# Altium schematic sheet DB Connectors.SchDoc: DB Connectors
size B; DrawnBy: Jasper Yun; SheetNumber: 1; SheetTotal: 3; Competition: SAC 2021; Subteam: Avionics; University: McGill University; Location: Montreal, Quebec; Project: Avionics Project Name; MRT: McGill Rocket Team
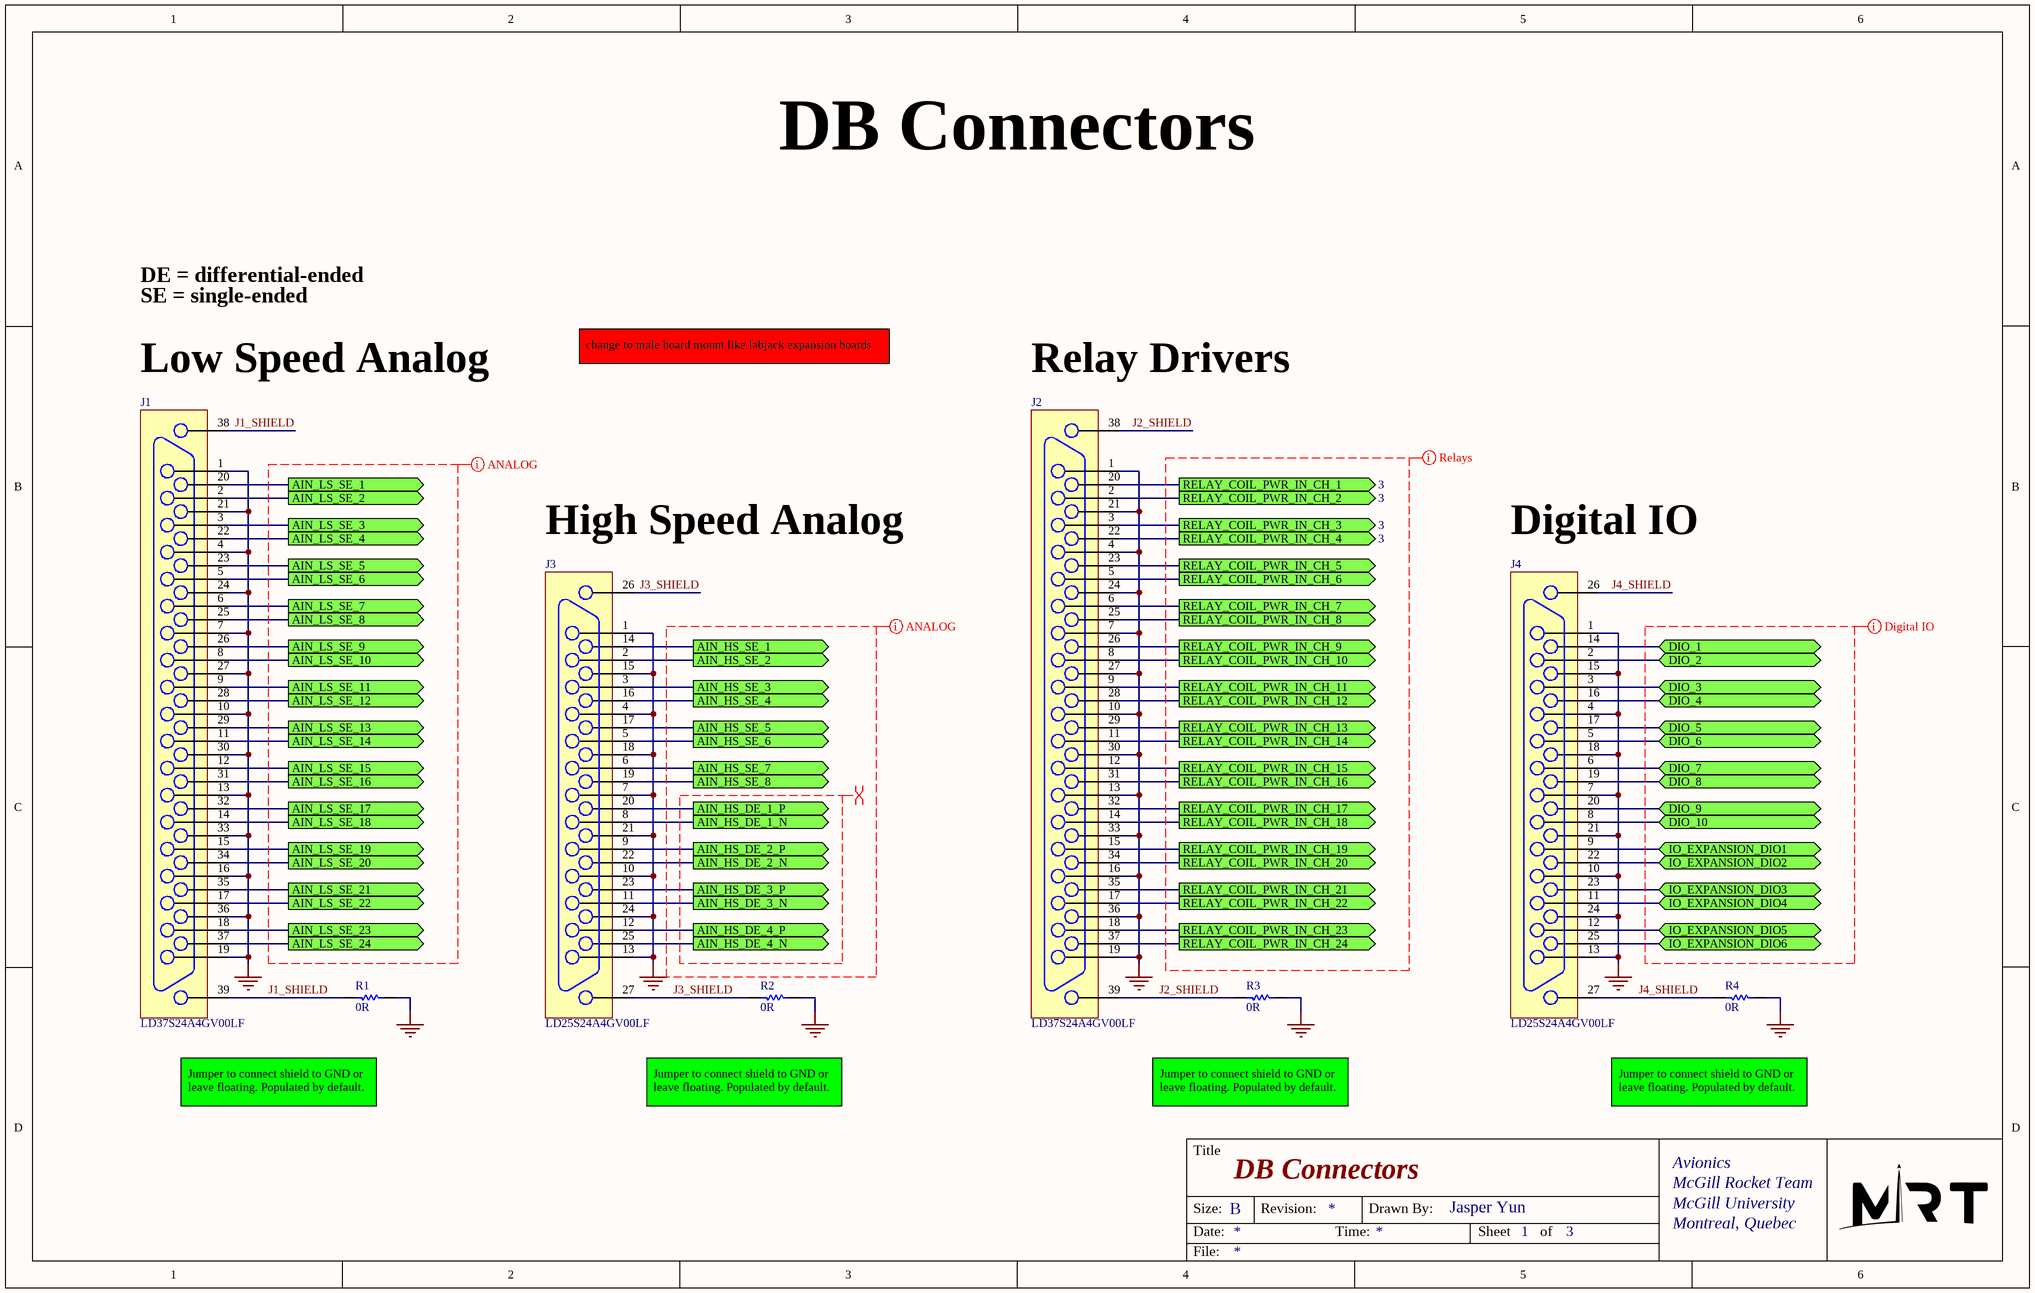
[diagram p0: DB Connectors.SchDoc]

## Parts
J1  LD37S24A4GV00LF  [Connector DB37 Vertical LD37S24A4GV00LF]
J2  LD37S24A4GV00LF  [Connector DB37 Vertical LD37S24A4GV00LF]
J3  LD25S24A4GV00LF  [Connector DB25 Vertical LD25S24A4GV00LF]
J4  LD25S24A4GV00LF  [Connector DB25 Vertical LD25S24A4GV00LF]
R1  0R  [0402 RES]
R2  0R  [0402 RES]
R3  0R  [0402 RES]
R4  0R  [0402 RES]

## Ports
AIN_HS_DE_1_N (out), AIN_HS_DE_1_P (out), AIN_HS_DE_2_N (out), AIN_HS_DE_2_P (out), AIN_HS_DE_3_N (out), AIN_HS_DE_3_P (out), AIN_HS_DE_4_N (out), AIN_HS_DE_4_P (out), AIN_HS_SE_1 (out), AIN_HS_SE_2 (out), AIN_HS_SE_3 (out), AIN_HS_SE_4 (out), AIN_HS_SE_5 (out), AIN_HS_SE_6 (out), AIN_HS_SE_7 (out), AIN_HS_SE_8 (out), AIN_LS_SE_1 (out), AIN_LS_SE_2 (out), AIN_LS_SE_3 (out), AIN_LS_SE_4 (out), AIN_LS_SE_5 (out), AIN_LS_SE_6 (out), AIN_LS_SE_7 (out), AIN_LS_SE_8 (out), AIN_LS_SE_9 (out), AIN_LS_SE_10 (out), AIN_LS_SE_11 (out), AIN_LS_SE_12 (out), AIN_LS_SE_13 (out), AIN_LS_SE_14 (out), AIN_LS_SE_15 (out), AIN_LS_SE_16 (out), AIN_LS_SE_17 (out), AIN_LS_SE_18 (out), AIN_LS_SE_19 (out), AIN_LS_SE_20 (out), AIN_LS_SE_21 (out), AIN_LS_SE_22 (out), AIN_LS_SE_23 (out), AIN_LS_SE_24 (out), DIO_1 (bidir), DIO_2 (bidir), DIO_3 (bidir), DIO_4 (bidir), DIO_5 (bidir), DIO_6 (bidir), DIO_7 (bidir), DIO_8 (bidir), DIO_9 (bidir), DIO_10 (bidir), IO_EXPANSION_DIO1 (bidir), IO_EXPANSION_DIO2 (bidir), IO_EXPANSION_DIO3 (bidir), IO_EXPANSION_DIO4 (bidir), IO_EXPANSION_DIO5 (bidir), IO_EXPANSION_DIO6 (bidir), RELAY_COIL_PWR_IN_CH_1 (out, see 3), RELAY_COIL_PWR_IN_CH_2 (out, see 3), RELAY_COIL_PWR_IN_CH_3 (out, see 3), RELAY_COIL_PWR_IN_CH_4 (out, see 3), RELAY_COIL_PWR_IN_CH_5 (out), RELAY_COIL_PWR_IN_CH_6 (out), RELAY_COIL_PWR_IN_CH_7 (out), RELAY_COIL_PWR_IN_CH_8 (out), RELAY_COIL_PWR_IN_CH_9 (out), RELAY_COIL_PWR_IN_CH_10 (out), RELAY_COIL_PWR_IN_CH_11 (out), RELAY_COIL_PWR_IN_CH_12 (out), RELAY_COIL_PWR_IN_CH_13 (out), RELAY_COIL_PWR_IN_CH_14 (out), RELAY_COIL_PWR_IN_CH_15 (out), RELAY_COIL_PWR_IN_CH_16 (out), RELAY_COIL_PWR_IN_CH_17 (out), RELAY_COIL_PWR_IN_CH_18 (out), RELAY_COIL_PWR_IN_CH_19 (out), RELAY_COIL_PWR_IN_CH_20 (out), RELAY_COIL_PWR_IN_CH_21 (out), RELAY_COIL_PWR_IN_CH_22 (out), RELAY_COIL_PWR_IN_CH_23 (out), RELAY_COIL_PWR_IN_CH_24 (out)

## Nets
GND: J1.1 J1.4 J1.7 J1.10 J1.13 J1.16 J1.19 J1.21 J1.24 J1.27 J1.30 J1.33 J1.36 J2.1 J2.4 J2.7 J2.10 J2.13 J2.16 J2.19 J2.21 J2.24 J2.27 J2.30 J2.33 J2.36 J3.1 J3.4 J3.7 J3.10 J3.13 J3.15 J3.18 J3.21 J3.24 J4.1 J4.4 J4.7 J4.10 J4.13 J4.15 J4.18 J4.21 J4.24 R1.2 R2.2 R3.2 R4.2
AIN_HS_DE_1_N: J3.8 ; port AIN_HS_DE_1_N
AIN_HS_DE_1_P: J3.20 ; port AIN_HS_DE_1_P
AIN_HS_DE_2_N: J3.22 ; port AIN_HS_DE_2_N
AIN_HS_DE_2_P: J3.9 ; port AIN_HS_DE_2_P
AIN_HS_DE_3_N: J3.11 ; port AIN_HS_DE_3_N
AIN_HS_DE_3_P: J3.23 ; port AIN_HS_DE_3_P
AIN_HS_DE_4_N: J3.25 ; port AIN_HS_DE_4_N
AIN_HS_DE_4_P: J3.12 ; port AIN_HS_DE_4_P
AIN_HS_SE_1: J3.14 ; port AIN_HS_SE_1
AIN_HS_SE_2: J3.2 ; port AIN_HS_SE_2
AIN_HS_SE_3: J3.3 ; port AIN_HS_SE_3
AIN_HS_SE_4: J3.16 ; port AIN_HS_SE_4
AIN_HS_SE_5: J3.17 ; port AIN_HS_SE_5
AIN_HS_SE_6: J3.5 ; port AIN_HS_SE_6
AIN_HS_SE_7: J3.6 ; port AIN_HS_SE_7
AIN_HS_SE_8: J3.19 ; port AIN_HS_SE_8
AIN_LS_SE_1: J1.20 ; port AIN_LS_SE_1
AIN_LS_SE_2: J1.2 ; port AIN_LS_SE_2
AIN_LS_SE_3: J1.3 ; port AIN_LS_SE_3
AIN_LS_SE_4: J1.22 ; port AIN_LS_SE_4
AIN_LS_SE_5: J1.23 ; port AIN_LS_SE_5
AIN_LS_SE_6: J1.5 ; port AIN_LS_SE_6
AIN_LS_SE_7: J1.6 ; port AIN_LS_SE_7
AIN_LS_SE_8: J1.25 ; port AIN_LS_SE_8
AIN_LS_SE_9: J1.26 ; port AIN_LS_SE_9
AIN_LS_SE_10: J1.8 ; port AIN_LS_SE_10
AIN_LS_SE_11: J1.9 ; port AIN_LS_SE_11
AIN_LS_SE_12: J1.28 ; port AIN_LS_SE_12
AIN_LS_SE_13: J1.29 ; port AIN_LS_SE_13
AIN_LS_SE_14: J1.11 ; port AIN_LS_SE_14
AIN_LS_SE_15: J1.12 ; port AIN_LS_SE_15
AIN_LS_SE_16: J1.31 ; port AIN_LS_SE_16
AIN_LS_SE_17: J1.32 ; port AIN_LS_SE_17
AIN_LS_SE_18: J1.14 ; port AIN_LS_SE_18
AIN_LS_SE_19: J1.15 ; port AIN_LS_SE_19
AIN_LS_SE_20: J1.34 ; port AIN_LS_SE_20
AIN_LS_SE_21: J1.35 ; port AIN_LS_SE_21
AIN_LS_SE_22: J1.17 ; port AIN_LS_SE_22
AIN_LS_SE_23: J1.18 ; port AIN_LS_SE_23
AIN_LS_SE_24: J1.37 ; port AIN_LS_SE_24
DIO_1: J4.14 ; port DIO_1
DIO_2: J4.2 ; port DIO_2
DIO_3: J4.3 ; port DIO_3
DIO_4: J4.16 ; port DIO_4
DIO_5: J4.17 ; port DIO_5
DIO_6: J4.5 ; port DIO_6
DIO_7: J4.6 ; port DIO_7
DIO_8: J4.19 ; port DIO_8
DIO_9: J4.20 ; port DIO_9
DIO_10: J4.8 ; port DIO_10
IO_EXPANSION_DIO1: J4.9 ; port IO_EXPANSION_DIO1
IO_EXPANSION_DIO2: J4.22 ; port IO_EXPANSION_DIO2
IO_EXPANSION_DIO3: J4.23 ; port IO_EXPANSION_DIO3
IO_EXPANSION_DIO4: J4.11 ; port IO_EXPANSION_DIO4
IO_EXPANSION_DIO5: J4.12 ; port IO_EXPANSION_DIO5
IO_EXPANSION_DIO6: J4.25 ; port IO_EXPANSION_DIO6
J1_SHIELD: J1.38 J1.39 R1.1
J2_SHIELD: J2.38 J2.39 R3.1
J3_SHIELD: J3.26 J3.27 R2.1
J4_SHIELD: J4.26 J4.27 R4.1
RELAY_COIL_PWR_IN_CH_1: J2.20 ; port RELAY_COIL_PWR_IN_CH_1
RELAY_COIL_PWR_IN_CH_2: J2.2 ; port RELAY_COIL_PWR_IN_CH_2
RELAY_COIL_PWR_IN_CH_3: J2.3 ; port RELAY_COIL_PWR_IN_CH_3
RELAY_COIL_PWR_IN_CH_4: J2.22 ; port RELAY_COIL_PWR_IN_CH_4
RELAY_COIL_PWR_IN_CH_5: J2.23 ; port RELAY_COIL_PWR_IN_CH_5
RELAY_COIL_PWR_IN_CH_6: J2.5 ; port RELAY_COIL_PWR_IN_CH_6
RELAY_COIL_PWR_IN_CH_7: J2.6 ; port RELAY_COIL_PWR_IN_CH_7
RELAY_COIL_PWR_IN_CH_8: J2.25 ; port RELAY_COIL_PWR_IN_CH_8
RELAY_COIL_PWR_IN_CH_9: J2.26 ; port RELAY_COIL_PWR_IN_CH_9
RELAY_COIL_PWR_IN_CH_10: J2.8 ; port RELAY_COIL_PWR_IN_CH_10
RELAY_COIL_PWR_IN_CH_11: J2.9 ; port RELAY_COIL_PWR_IN_CH_11
RELAY_COIL_PWR_IN_CH_12: J2.28 ; port RELAY_COIL_PWR_IN_CH_12
RELAY_COIL_PWR_IN_CH_13: J2.29 ; port RELAY_COIL_PWR_IN_CH_13
RELAY_COIL_PWR_IN_CH_14: J2.11 ; port RELAY_COIL_PWR_IN_CH_14
RELAY_COIL_PWR_IN_CH_15: J2.12 ; port RELAY_COIL_PWR_IN_CH_15
RELAY_COIL_PWR_IN_CH_16: J2.31 ; port RELAY_COIL_PWR_IN_CH_16
RELAY_COIL_PWR_IN_CH_17: J2.32 ; port RELAY_COIL_PWR_IN_CH_17
RELAY_COIL_PWR_IN_CH_18: J2.14 ; port RELAY_COIL_PWR_IN_CH_18
RELAY_COIL_PWR_IN_CH_19: J2.15 ; port RELAY_COIL_PWR_IN_CH_19
RELAY_COIL_PWR_IN_CH_20: J2.34 ; port RELAY_COIL_PWR_IN_CH_20
RELAY_COIL_PWR_IN_CH_21: J2.35 ; port RELAY_COIL_PWR_IN_CH_21
RELAY_COIL_PWR_IN_CH_22: J2.17 ; port RELAY_COIL_PWR_IN_CH_22
RELAY_COIL_PWR_IN_CH_23: J2.18 ; port RELAY_COIL_PWR_IN_CH_23
RELAY_COIL_PWR_IN_CH_24: J2.37 ; port RELAY_COIL_PWR_IN_CH_24

## Layout directives
differential pair; differential pair class AIN_HS_DE: (no net found under the mark)
net class ANALOG: (no net found under the mark)
net class Digital IO: (no net found under the mark)
net class Relays: (no net found under the mark)

## Notes on the sheet
- DE = differential-ended
- SE = single-ended
- change to male board mount like labjack expansion boards
- (near J1) Low Speed Analog
- (near J2) Relay Drivers
- (near J3) High Speed Analog
- (near J4) Digital IO
- Jumper to connect shield to GND or leave floating. Populated by default.
- Title
- Size:
- Date:
- B
- Revision:
- Time:
- Drawn By:
- Sheet
- of
- File:

## Library data of the parts
J1 J2 = Connector DB37 (LD37S24A4GV00LF): DB37 LD37S24A4GV00LF (Amphenol ICC)
J3 J4 = Connector DB25 (LD25S24A4GV00LF): DB25 LD25S24A4GV00LF (Amphenol ICC)
R1-R4 = Res1: Resistor; Value: 1%; Published: 8-Jun-2000; LatestRevisionDate: 17-Jul-2002; LatestRevisionNote: Re-released for DXP Platform.; PackageReference: AXIAL-0.3; Publisher: Altium Limited; PackageDescription: Axial Device, Thru-Hole; 2 Leads; 0.3 in Pin Spacing